# Altium schematic sheet connector_to_BMS_extension.SchDoc: foxBMS BMS-Master
size A3; DocumentNumber: 24; SheetNumber: 24; SheetTotal: 24; Author: Fraunhofer IISB foxBMS Team; REL-DATE: 2017-05-16; VERSION: 1.0.2; SheetDescription: Connectors to BMS-Extension
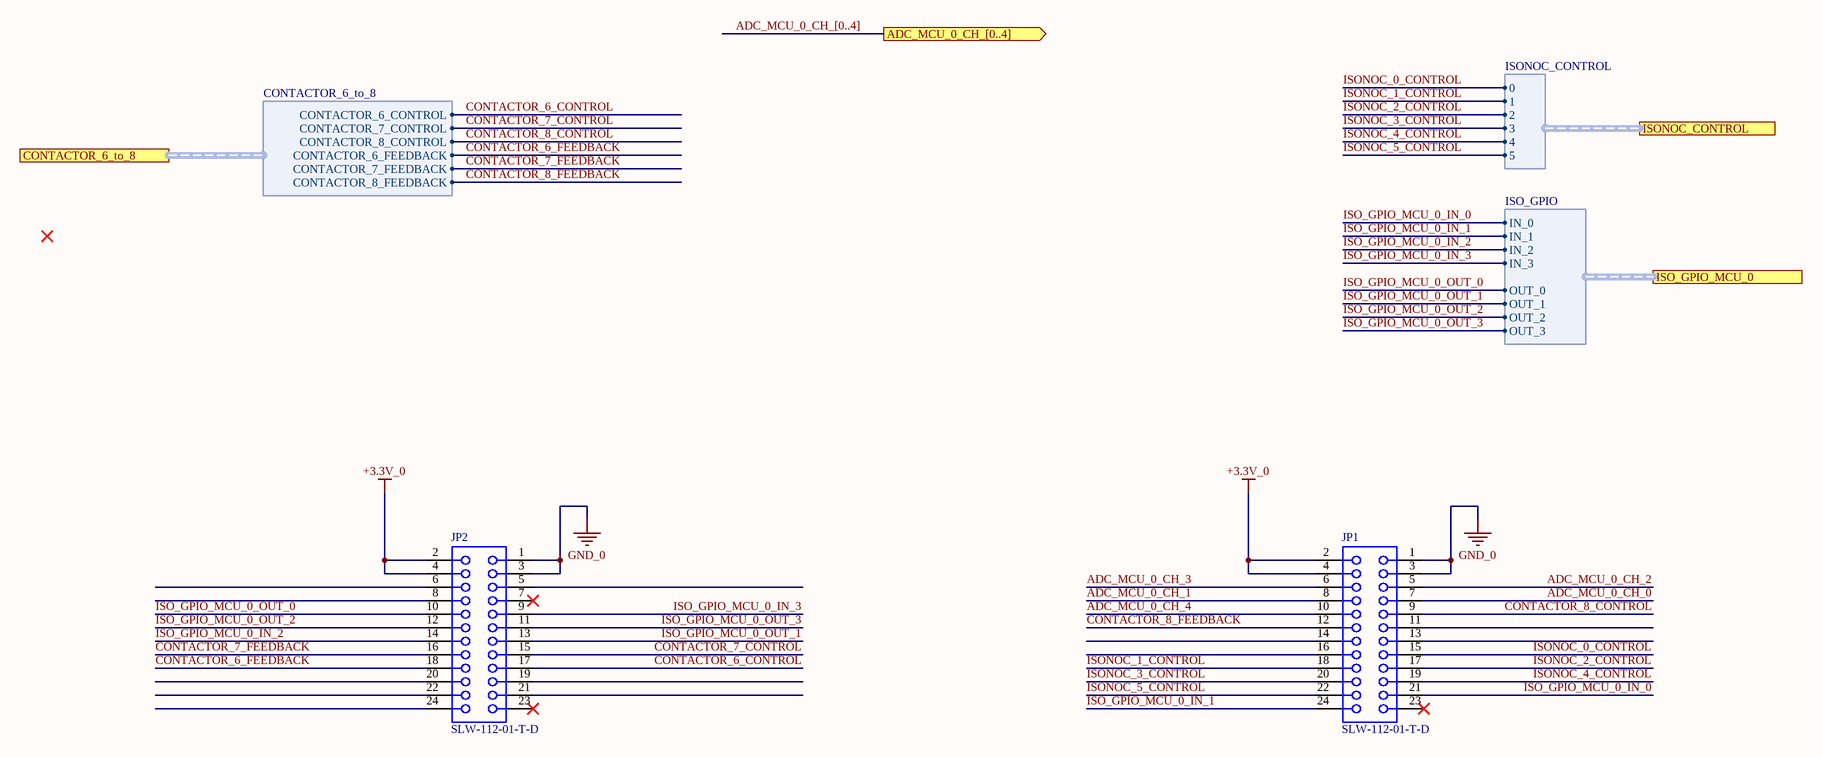
[diagram p0: connector_to_BMS_extension.SchDoc]

## Parts
JP1  SLW-112-01-T-D  [SMTC-SLW-112-01-X-D]
JP2  SLW-112-01-T-D  [SMTC-SLW-112-01-X-D]

## Ports
ADC_MCU_0_CH_[0..4] (out), CONTACTOR_6_to_8 (harness CONTACTOR_6_to_8), ISO_GPIO_MCU_0 (harness ISO_GPIO), ISONOC_CONTROL (harness ISONOC_CONTROL)

## Harnesses
CONTACTOR_6_to_8: CONTACTOR_6_CONTROL, CONTACTOR_7_CONTROL, CONTACTOR_8_CONTROL, CONTACTOR_6_FEEDBACK, CONTACTOR_7_FEEDBACK, CONTACTOR_8_FEEDBACK
ISONOC_CONTROL: 0, 1, 2, 3, 4, 5
ISO_GPIO: IN_0, IN_1, IN_2, IN_3, OUT_3, OUT_0, OUT_1, OUT_2

## Nets
+3.3V_0: JP1.2 JP1.4 JP2.2 JP2.4
GND_0: JP1.1 JP1.3 JP2.1 JP2.3
ADC_MCU_0_CH_0: JP1.7
ADC_MCU_0_CH_1: JP1.8
ADC_MCU_0_CH_2: JP1.5
ADC_MCU_0_CH_3: JP1.6
ADC_MCU_0_CH_4: JP1.10
CONTACTOR_6_CONTROL: JP2.17 ; port CONTACTOR_6_to_8.CONTACTOR_6_CONTROL
CONTACTOR_6_FEEDBACK: JP2.18 ; port CONTACTOR_6_to_8.CONTACTOR_6_FEEDBACK
CONTACTOR_7_CONTROL: JP2.15 ; port CONTACTOR_6_to_8.CONTACTOR_7_CONTROL
CONTACTOR_7_FEEDBACK: JP2.16 ; port CONTACTOR_6_to_8.CONTACTOR_7_FEEDBACK
CONTACTOR_8_CONTROL: JP1.9 ; port CONTACTOR_6_to_8.CONTACTOR_8_CONTROL
CONTACTOR_8_FEEDBACK: JP1.12 ; port CONTACTOR_6_to_8.CONTACTOR_8_FEEDBACK
ISO_GPIO_MCU_0_IN_0: JP1.21 ; port ISO_GPIO_MCU_0.IN_0
ISO_GPIO_MCU_0_IN_1: JP1.24 ; port ISO_GPIO_MCU_0.IN_1
ISO_GPIO_MCU_0_IN_2: JP2.14 ; port ISO_GPIO_MCU_0.IN_2
ISO_GPIO_MCU_0_IN_3: JP2.9 ; port ISO_GPIO_MCU_0.IN_3
ISO_GPIO_MCU_0_OUT_0: JP2.10 ; port ISO_GPIO_MCU_0.OUT_0
ISO_GPIO_MCU_0_OUT_1: JP2.13 ; port ISO_GPIO_MCU_0.OUT_1
ISO_GPIO_MCU_0_OUT_2: JP2.12 ; port ISO_GPIO_MCU_0.OUT_2
ISO_GPIO_MCU_0_OUT_3: JP2.11 ; port ISO_GPIO_MCU_0.OUT_3
ISONOC_0_CONTROL: JP1.15 ; port ISONOC_CONTROL.0
ISONOC_1_CONTROL: JP1.18 ; port ISONOC_CONTROL.1
ISONOC_2_CONTROL: JP1.17 ; port ISONOC_CONTROL.2
ISONOC_3_CONTROL: JP1.20 ; port ISONOC_CONTROL.3
ISONOC_4_CONTROL: JP1.19 ; port ISONOC_CONTROL.4
ISONOC_5_CONTROL: JP1.22 ; port ISONOC_CONTROL.5

Not connected (* = marked no-connect by the designer): JP1 11 13 14 16 23*; JP2 5 6 7* 8 19 20 21 22 23* 24

## Buses and harness runs
bus ADC_MCU_0_CH_[0..4] = port ADC_MCU_0_CH_[0..4]

## Notes on the sheet
- Fraunhofer IISB
- Schottkystr. 10
- developed by:
- 91058 Erlangen
- Germany
- Author
- Project
- License
- Description
- File
- Version
- Release Date
- Sheet
- www.foxbms.org
- www.iisb.fraunhofer.de
- foxBMS Team
- /

## Library data of the parts
JP1 JP2 = CMP-1023-00145-1: Low Profile Socket Strips, Through-hole, Vertical, -55 to 105 degC, 2.54 mm Pitch, 24-Pin, Female, RoHS; Manufacturer: Samtec; Pitch: 2.54 mm; System: Connector; DatasheetVersion: F-214; ComponentLink3Description: Package Specification; Orientation: Vertical; ComponentLink3URL: http://www.samtec.com/documents/webfiles/cpdf/SLW-1XX-01-X-X-MKT.pdf; ComponentLink1URL: http://www.samtec.com; Temperature Range: -55 to 105 degC; PackageReference: SLW-112-01-X-D; PartNumber: SLW-112-01-T-D; ComponentLink1Description: Manufacturer URL; PackageDescription: Low Profile Socket Strip; Mounting Technology: Through-hole; ComponentLink2Description: Datasheet; RoHS: True; ComponentLink2URL: http://www.samtec.com/documents/webfiles/pdf/SLW.PDF; PackageVersion: X, 9/1987; Part Number: SLW-112-01-T-D